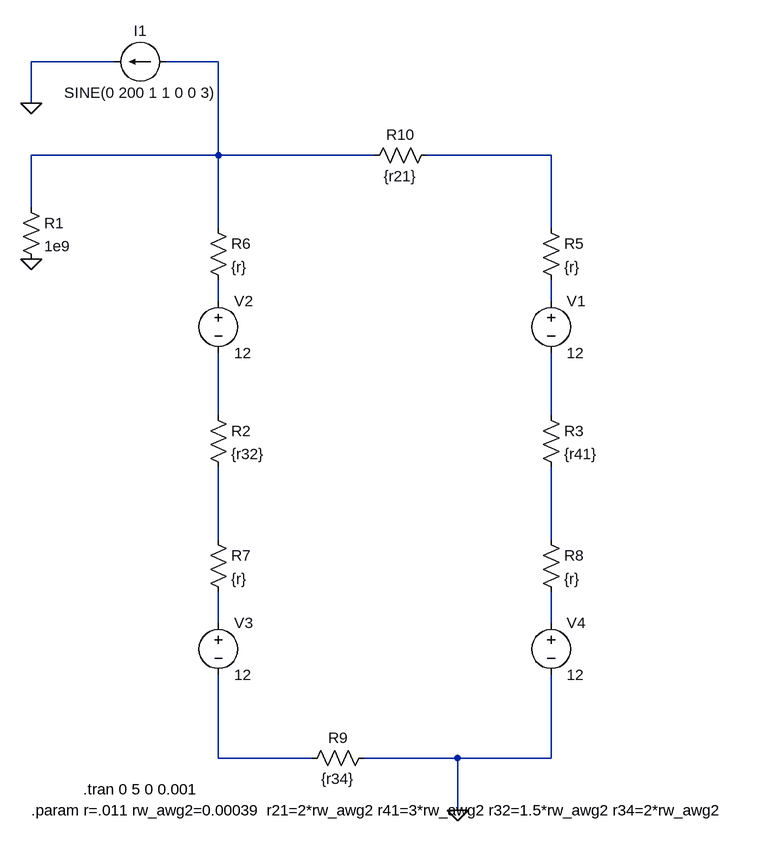
[diagram p0: schematic 2s2p_batt_test.asc]
2s2p_batt_test.asc, the LTspice schematic file:
Version 4
SHEET 1 1584 936
WIRE -112 -352 -240 -352
WIRE 48 -352 -32 -352
WIRE -240 -288 -240 -352
WIRE 48 -208 48 -352
WIRE 48 -208 -240 -208
WIRE 288 -208 48 -208
WIRE 560 -208 368 -208
WIRE -240 -128 -240 -208
WIRE 48 -96 48 -208
WIRE 560 -96 560 -208
WIRE 48 16 48 -16
WIRE 560 16 560 -16
WIRE 48 192 48 96
WIRE 560 192 560 96
WIRE 48 384 48 272
WIRE 560 384 560 272
WIRE 48 512 48 464
WIRE 560 512 560 464
WIRE 48 720 48 592
WIRE 192 720 48 720
WIRE 416 720 272 720
WIRE 560 720 560 592
WIRE 560 720 416 720
WIRE 416 800 416 720
FLAG 416 800 0
FLAG -240 -288 0
FLAG -240 -48 0
SYMBOL res 32 176 R0
SYMATTR InstName R2
SYMATTR Value {r32}
SYMBOL res 544 176 R0
SYMATTR InstName R3
SYMATTR Value {r41}
SYMBOL res 544 -112 R0
SYMATTR InstName R5
SYMATTR Value {r}
SYMBOL res 32 -112 R0
SYMATTR InstName R6
SYMATTR Value {r}
SYMBOL res 32 368 R0
SYMATTR InstName R7
SYMATTR Value {r}
SYMBOL res 544 368 R0
SYMATTR InstName R8
SYMATTR Value {r}
SYMBOL res 288 704 R90
WINDOW 0 0 56 VBottom 2
WINDOW 3 32 56 VTop 2
SYMATTR InstName R9
SYMATTR Value {r34}
SYMBOL res 384 -224 R90
WINDOW 0 0 56 VBottom 2
WINDOW 3 32 56 VTop 2
SYMATTR InstName R10
SYMATTR Value {r21}
SYMBOL voltage 560 0 R0
WINDOW 123 0 0 Left 0
WINDOW 39 0 0 Left 0
SYMATTR InstName V1
SYMATTR Value 12
SYMBOL voltage 48 0 R0
WINDOW 123 0 0 Left 0
WINDOW 39 0 0 Left 0
SYMATTR InstName V2
SYMATTR Value 12
SYMBOL voltage 48 496 R0
WINDOW 123 0 0 Left 0
WINDOW 39 0 0 Left 0
SYMATTR InstName V3
SYMATTR Value 12
SYMBOL voltage 560 496 R0
WINDOW 123 0 0 Left 0
WINDOW 39 0 0 Left 0
SYMATTR InstName V4
SYMATTR Value 12
SYMBOL current -32 -352 R90
WINDOW 0 -32 40 VBottom 2
WINDOW 3 32 40 VTop 2
WINDOW 123 0 0 Left 0
WINDOW 39 0 0 Left 0
SYMATTR InstName I1
SYMATTR Value SINE(0 200 1 1 0 0 3)
SYMBOL res -256 -144 R0
SYMATTR InstName R1
SYMATTR Value 1e9
TEXT -160 768 Left 2 !.tran 0 5 0 0.001
TEXT -240 800 Left 2 !.param r=.011 rw_awg2=0.00039  r21=2*rw_awg2 r41=3*rw_awg2 r32=1.5*rw_awg2 r34=2*rw_awg2

The netlist it stands for:
* 2s2p_batt_test.asc
R2 N005 N007 {r32}
R3 N006 N008 {r41}
R5 N002 N004 {r}
R6 N001 N003 {r}
R7 N007 N009 {r}
R8 N008 N010 {r}
R9 0 N011 {r34}
R10 N002 N001 {r21}
V1 N004 N006 12
V2 N003 N005 12
V3 N009 N011 12
V4 N010 0 12
I1 N001 0 SINE(0 200 1 1 0 0 3)
R1 N001 0 1e9
.tran 0 5 0 0.001
.param r=.011 rw_awg2=0.00039  r21=2*rw_awg2 r41=3*rw_awg2 r32=1.5*rw_awg2 r34=2*rw_awg2
.backanno
.end